# Altium schematic sheet OSC_PLL_SARDC_OPTeFUSE.SchDoc
size A3; SheetNumber: 6; SheetTotal: 18
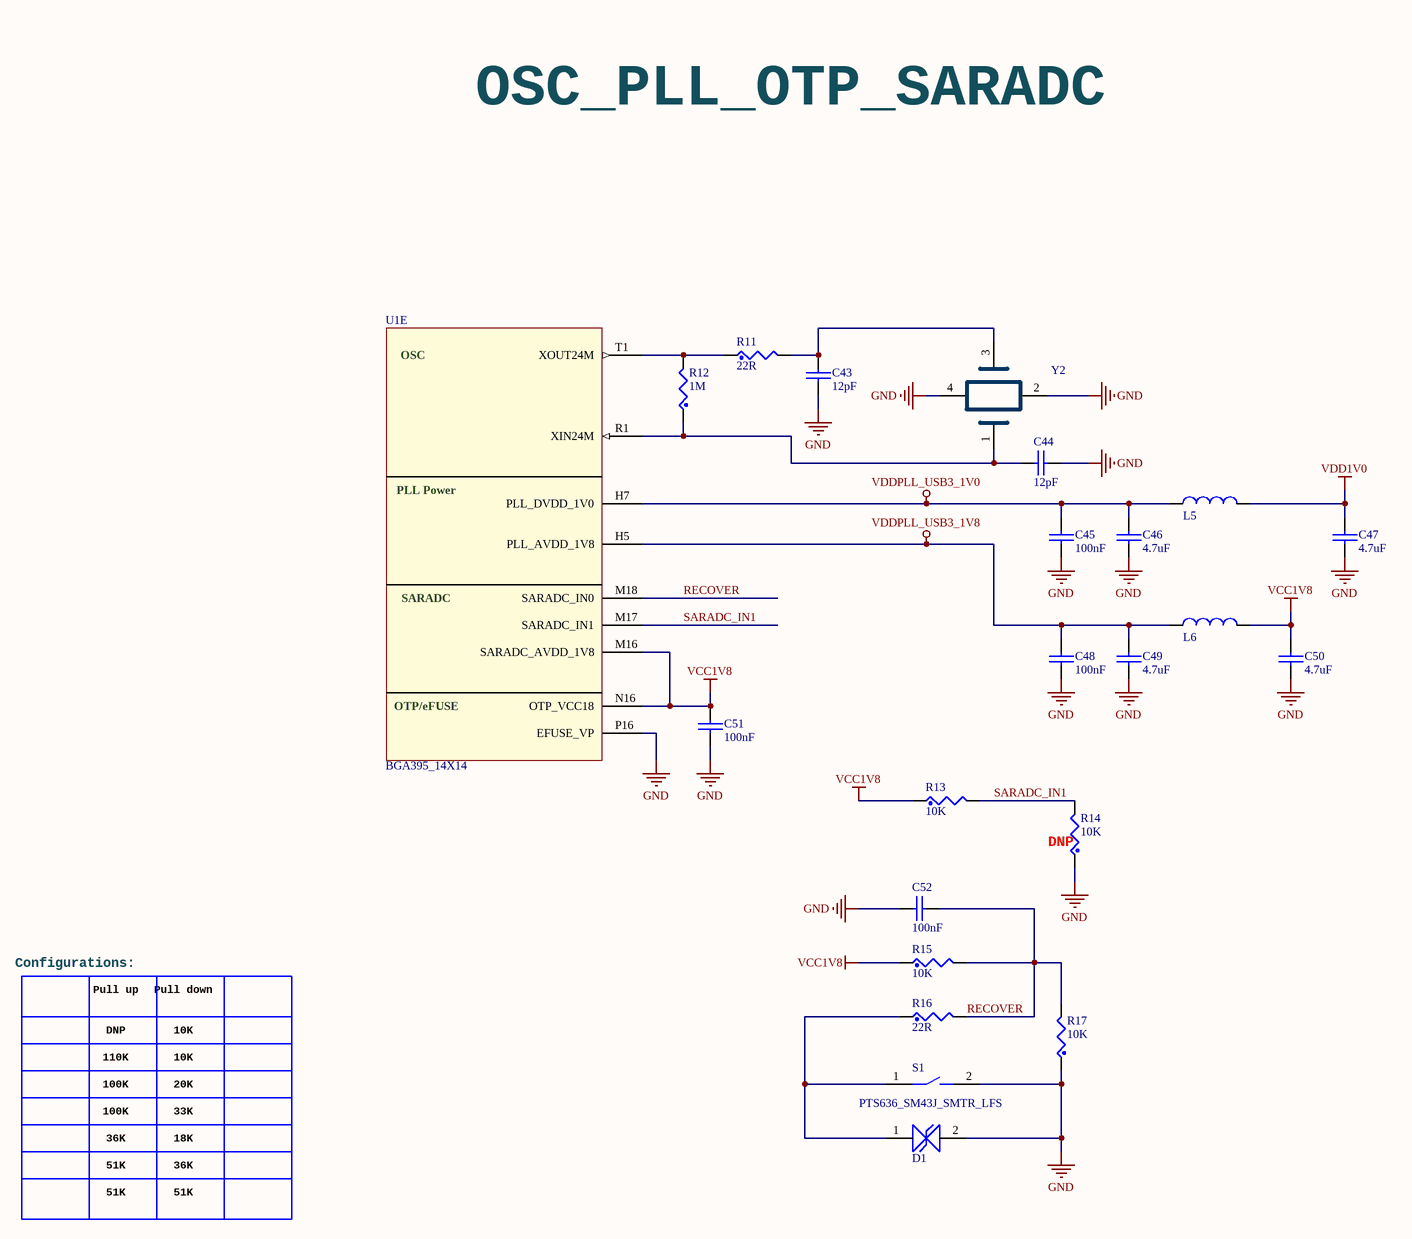
[diagram p0: OSC_PLL_SARDC_OPTeFUSE.SchDoc]

## Parts
C43  12pF  [0402_CC - C]
C44  12pF  [0402_CC - C]
C45  100nF  [0402_CC - C]
C46  4.7uF  [0402_CC - C]
C47  4.7uF  [0402_CC - C]
C48  100nF  [0402_CC - C]
C49  4.7uF  [0402_CC - C]
C50  4.7uF  [0402_CC - C]
C51  100nF  [0402_CC - C]
C52  100nF  [0402_CC - C]
D1  TVS  [SODFL100X45-2N]  (value not drawn)
L5  INDCHIP  [0603_C_Inductor]  (value not drawn)
L6  INDCHIP  [0603_C_Inductor]  (value not drawn)
R11  22R  [0402_CR]
R12  1M  [0402_CR]
R13  10K  [0402_CR]
R14  10K  [0402_CR]
R15  10K  [0402_CR]
R16  22R  [0402_CR]
R17  10K  [0402_CR]
S1  PTS636_SM43J_SMTR_LFS  [PTS636_3.5_6_4.3]
U1  BGA395_14X14  [BGA395C65P21X21_1750X1750X117]  (part E of 17)
Y2  7R-24.000MEEC-T  [7R24000MEECT]  (value not drawn)

## Nets
GND: C43.1 C44.1 C45.2 C46.2 C47.2 C48.2 C49.2 C50.2 C51.2 C52.1 D1.2 R14.1 R17.1 S1.2 U1.P16(EFUSE_VP) Y2.2(NC_1) Y2.4(NC_2)
VCC1V8: C50.1 C51.1 L6.2 R13.1 R15.1 U1.M16(SARADC_AVDD_1V8) U1.N16(OTP_VCC18)
VDD1V0: C47.1 L5.2
VDDPLL_USB3_1V0: C45.1 C46.1 L5.1 U1.H7(PLL_DVDD_1V0)
VDDPLL_USB3_1V8: C48.1 C49.1 L6.1 U1.H5(PLL_AVDD_1V8)
RECOVER: C52.2 R15.2 R16.2 R17.2 U1.M18(SARADC_IN0)
SARADC_IN1: R13.2 R14.2 U1.M17(SARADC_IN1)
NetC43_2: C43.2 R11.2 Y2.3(X1_2)
NetC44_2: C44.2 R12.1 U1.R1(XIN24M) Y2.1(X1_1)
NetD1_1: D1.1 R16.1 S1.1
NetR11_1: R11.1 R12.2 U1.T1(XOUT24M)

## Notes on the sheet
- OSC_PLL_OTP_SARADC
- (near R14) DNP
- Configurations:
- Pull up
- Pull down
- DNP
- 110K
- 100K
- 10K
- 20K
- 36K
- 33K
- 18K
- 51K
- (in symbol RK3328, part E) OSC; PLL Power; SARADC; OTP/eFUSE

## Library data of the parts
C43-C52 = CAP_NP: CLASS: DISCRETE
D1 = ESD5451N: AZ5825-01F, Bi-directional TVS, Working Voltage = 5V, Transient protection IEC61000-4-2 : +-30KV,  By AAR; Mfr_Part_No: ESD5451N-2/TR; ComponentLink1Description: Supplier; ComponentLink1URL: https://lcsc.com/product-detail/TVS_Will-Semicon-ESD5451N-2-TR_C239604.html; LCSC Part #: C239604; Package/Case: =Footprint
L5 L6 = INDCHIP: Fixed Inductors  TDK, By AAR
R11-R17 = RES: CLASS: DISCRETE
S1 = PTS636: Tactile Switches Tact 50mA 12VDC, 6.0x3.5, 4.3mm H, 180gf, J leads, No ground pin, Black Actuator; Mfr_Part_No: PTS636 SM43J SMTR LFS; Mouser No: 611-PTS636SM43JSMTRL
U1 = RK3328: By AAR
Y2 = 7R-24.000MEEC-T: AAR, Crystal or Oscillator; Mfr: TXC; Datasheet Link: https://www.mouser.com/datasheet/2/417/7r-1771103.pdf; Height: 0.6mm; Mfr_Part_No: 7R-24.000MEEC-T; Mouser No: 717-7R-24.000MEEC-T